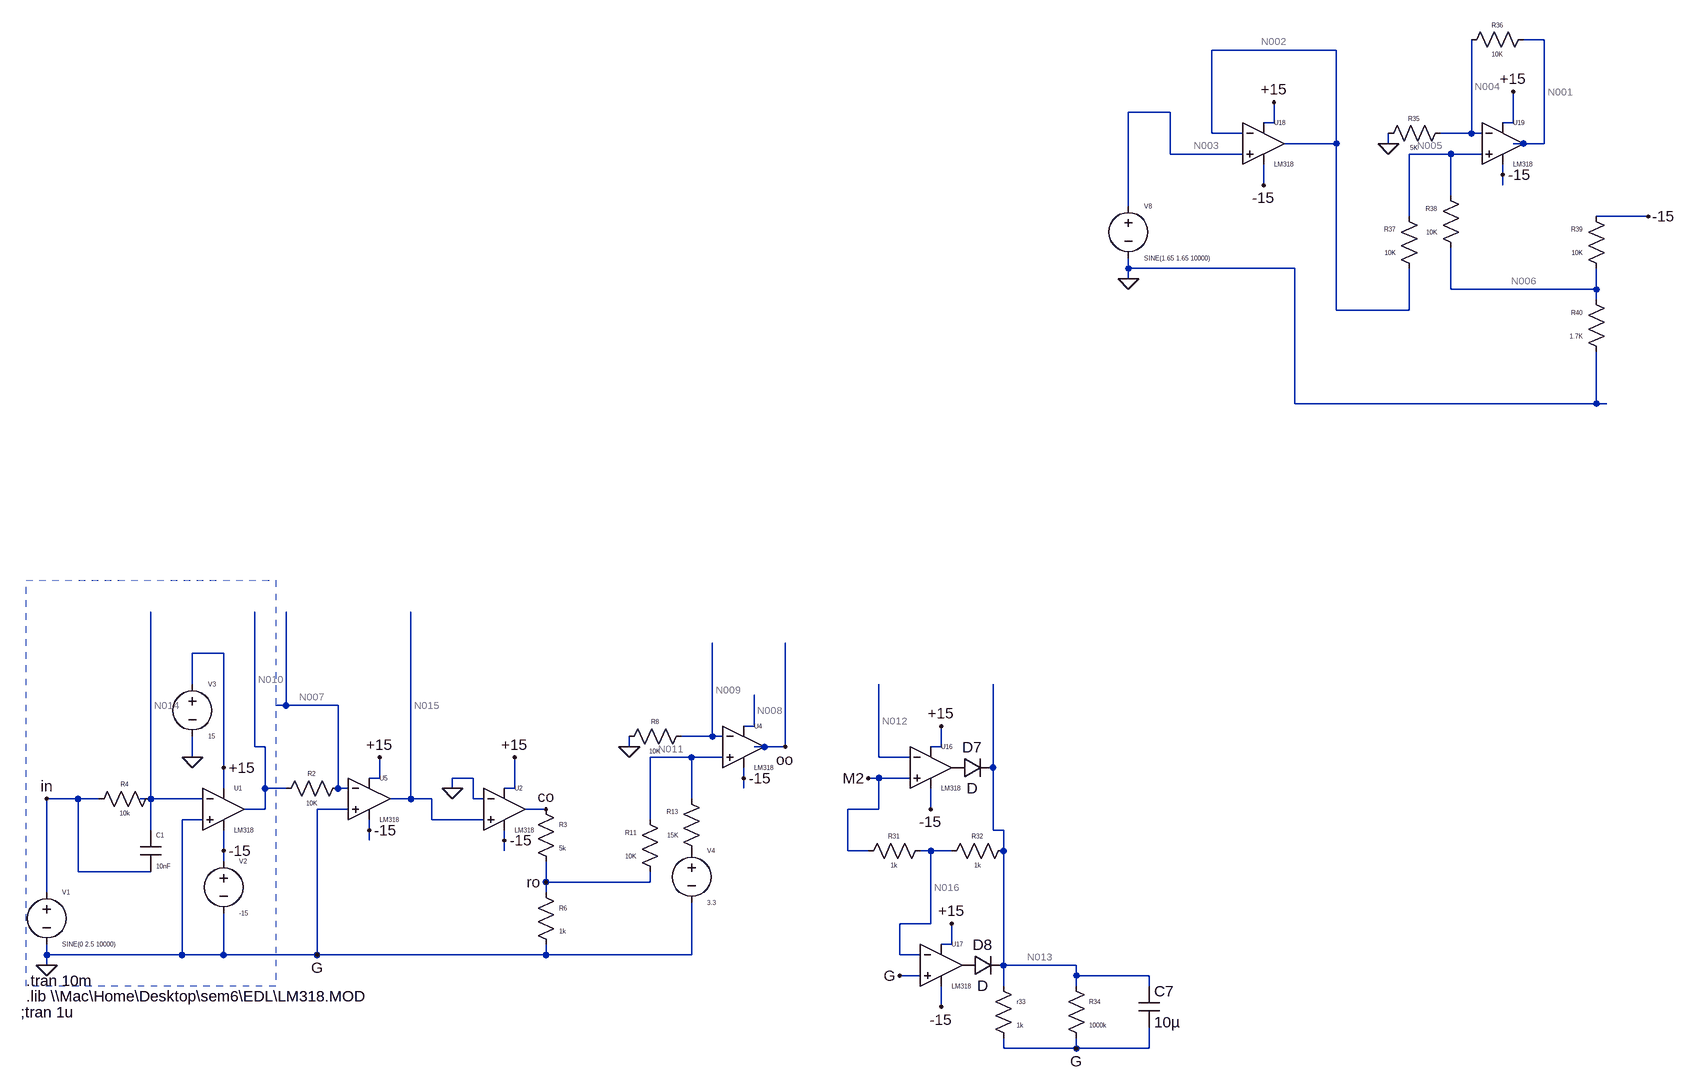
[diagram p0: schematic sir_lm.asc]
sir_lm.asc, the LTspice schematic file:
Version 4
SHEET 1 2856 1484
WIRE 2640 -1200 2608 -1200
WIRE 2320 -1184 2128 -1184
WIRE 2064 -1088 2000 -1088
WIRE 2224 -1072 2224 -1104
WIRE 2224 -1072 2208 -1072
WIRE 2592 -1072 2592 -1120
WIRE 2592 -1072 2576 -1072
WIRE 2128 -1056 2128 -1184
WIRE 2176 -1056 2128 -1056
WIRE 2528 -1056 2528 -1200
WIRE 2528 -1056 2480 -1056
WIRE 2544 -1056 2528 -1056
WIRE 2320 -1040 2320 -1184
WIRE 2320 -1040 2240 -1040
WIRE 2400 -1040 2400 -1056
WIRE 2608 -1040 2592 -1040
WIRE 2640 -1040 2640 -1200
WIRE 2640 -1040 2608 -1040
WIRE 2064 -1024 2064 -1088
WIRE 2176 -1024 2064 -1024
WIRE 2496 -1024 2432 -1024
WIRE 2544 -1024 2496 -1024
WIRE 2576 -992 2576 -1008
WIRE 2208 -976 2208 -1008
WIRE 2576 -976 2576 -992
WIRE 2496 -960 2496 -1024
WIRE 2000 -944 2000 -1088
WIRE 2432 -928 2432 -1024
WIRE 2800 -928 2720 -928
WIRE 2000 -848 2000 -864
WIRE 2256 -848 2000 -848
WIRE 2000 -832 2000 -848
WIRE 2496 -816 2496 -880
WIRE 2720 -816 2720 -848
WIRE 2720 -816 2496 -816
WIRE 2720 -800 2720 -816
WIRE 2320 -784 2320 -1040
WIRE 2432 -784 2432 -848
WIRE 2432 -784 2320 -784
WIRE 2256 -640 2256 -848
WIRE 2720 -640 2720 -720
WIRE 2720 -640 2256 -640
WIRE 2736 -640 2720 -640
WIRE 608 -256 560 -256
WIRE 560 -208 560 -256
WIRE 704 -176 704 -320
WIRE 704 -176 688 -176
WIRE 784 -176 704 -176
WIRE 1424 -144 1424 -192
WIRE 1424 -144 1408 -144
WIRE 1360 -128 1360 -272
WIRE 1360 -128 1312 -128
WIRE 1376 -128 1360 -128
WIRE 656 -112 656 -320
WIRE 672 -112 656 -112
WIRE 1232 -112 1232 -128
WIRE 1440 -112 1424 -112
WIRE 1472 -112 1472 -272
WIRE 1472 -112 1440 -112
WIRE 1712 -112 1712 -144
WIRE 1712 -112 1696 -112
WIRE 560 -96 560 -128
WIRE 1328 -96 1264 -96
WIRE 1376 -96 1328 -96
WIRE 1616 -96 1616 -208
WIRE 1664 -96 1616 -96
WIRE 608 -80 608 -256
WIRE 1792 -80 1792 -208
WIRE 848 -64 848 -96
WIRE 848 -64 832 -64
WIRE 992 -64 960 -64
WIRE 1408 -64 1408 -80
WIRE 1616 -64 1600 -64
WIRE 1664 -64 1616 -64
WIRE 608 -48 608 -80
WIRE 672 -48 672 -112
WIRE 704 -48 672 -48
WIRE 784 -48 784 -176
WIRE 800 -48 784 -48
WIRE 960 -48 960 -64
WIRE 1056 -48 1056 -96
WIRE 1056 -48 1040 -48
WIRE 1408 -48 1408 -64
WIRE 384 -32 336 -32
WIRE 416 -32 384 -32
WIRE 496 -32 496 -320
WIRE 496 -32 480 -32
WIRE 576 -32 496 -32
WIRE 896 -32 896 -320
WIRE 896 -32 864 -32
WIRE 928 -32 896 -32
WIRE 992 -32 992 -64
WIRE 1008 -32 992 -32
WIRE 1328 -32 1328 -96
WIRE 672 -16 672 -48
WIRE 672 -16 640 -16
WIRE 800 -16 752 -16
WIRE 1104 -16 1072 -16
WIRE 1616 -16 1616 -64
WIRE 1616 -16 1568 -16
WIRE 1696 -16 1696 -48
WIRE 576 0 544 0
WIRE 928 0 928 -32
WIRE 1008 0 928 0
WIRE 1264 0 1264 -96
WIRE 496 16 496 -32
WIRE 832 16 832 0
WIRE 1792 16 1792 -80
WIRE 1808 16 1792 16
WIRE 832 32 832 16
WIRE 1040 32 1040 16
WIRE 608 48 608 16
WIRE 1040 48 1040 32
WIRE 1568 48 1568 -16
WIRE 1600 48 1568 48
WIRE 1696 48 1680 48
WIRE 1728 48 1696 48
WIRE 1808 48 1808 16
WIRE 608 64 608 48
WIRE 384 80 384 -32
WIRE 496 80 384 80
WIRE 1104 96 1104 64
WIRE 1264 96 1264 80
WIRE 1264 96 1104 96
WIRE 336 112 336 -32
WIRE 1104 112 1104 96
WIRE 1696 160 1696 48
WIRE 1696 160 1648 160
WIRE 1728 192 1728 160
WIRE 1728 192 1712 192
WIRE 336 208 336 192
WIRE 544 208 544 0
WIRE 544 208 336 208
WIRE 608 208 608 144
WIRE 608 208 544 208
WIRE 752 208 752 -16
WIRE 752 208 608 208
WIRE 1104 208 1104 192
WIRE 1104 208 752 208
WIRE 1328 208 1328 128
WIRE 1328 208 1104 208
WIRE 1648 208 1648 160
WIRE 1680 208 1648 208
WIRE 336 224 336 208
WIRE 1808 224 1808 48
WIRE 1920 224 1808 224
WIRE 1680 240 1648 240
WIRE 1920 240 1920 224
WIRE 2032 240 1920 240
WIRE 1808 256 1808 224
WIRE 1920 256 1920 240
WIRE 2032 256 2032 240
WIRE 1712 288 1712 256
WIRE 1808 352 1808 336
WIRE 1920 352 1920 336
WIRE 1920 352 1808 352
WIRE 2032 352 2032 320
WIRE 2032 352 1920 352
FLAG 336 224 0
FLAG 336 -32 in
FLAG 560 -96 0
FLAG 960 -48 0
FLAG 1104 -16 co
FLAG 608 -80 +15
FLAG 848 -96 +15
FLAG 1056 -96 +15
FLAG 608 48 -15
FLAG 832 16 -15
FLAG 1040 32 -15
FLAG 1104 96 ro
FLAG 1232 -112 0
FLAG 1408 -64 -15
FLAG 1472 -112 oo
FLAG 752 208 G
FLAG 1712 -144 +15
FLAG 1696 -16 -15
FLAG 1728 160 +15
FLAG 1712 288 -15
FLAG 1648 240 G
FLAG 1920 352 G
FLAG 1600 -64 M2
FLAG 2000 -832 0
FLAG 2224 -1104 +15
FLAG 2208 -976 -15
FLAG 2400 -1040 0
FLAG 2592 -1120 +15
FLAG 2576 -992 -15
FLAG 2800 -928 -15
SYMBOL voltage 336 96 R0
WINDOW 0 24 16 Left 0
WINDOW 3 24 96 Left 0
WINDOW 123 0 0 Left 0
WINDOW 39 0 0 Left 0
SYMATTR InstName V1
SYMATTR Value SINE(0 2.5 10000)
SYMBOL res 512 -48 R90
WINDOW 0 0 56 VBottom 0
WINDOW 3 32 56 VTop 0
SYMATTR InstName R4
SYMATTR Value 10k
SYMBOL voltage 608 48 R0
WINDOW 0 24 16 Left 0
WINDOW 3 24 96 Left 0
WINDOW 123 0 0 Left 0
WINDOW 39 0 0 Left 0
SYMATTR InstName V2
SYMATTR Value -15
SYMBOL voltage 560 -224 R0
WINDOW 0 24 16 Left 0
WINDOW 3 24 96 Left 0
WINDOW 123 0 0 Left 0
WINDOW 39 0 0 Left 0
SYMATTR InstName V3
SYMATTR Value 15
SYMBOL cap 480 16 R0
WINDOW 0 24 8 Left 0
WINDOW 3 24 56 Left 0
SYMATTR InstName C1
SYMATTR Value 10nF
SYMBOL Opamps\\opamp2 608 -80 R0
WINDOW 0 16 32 Left 0
WINDOW 3 16 96 Left 0
SYMATTR InstName U1
SYMATTR Value LM318
SYMBOL Opamps\\opamp2 1040 -80 R0
WINDOW 0 16 32 Left 0
WINDOW 3 16 96 Left 0
SYMATTR InstName U2
SYMATTR Value LM318
SYMBOL Opamps\\opamp2 832 -96 R0
WINDOW 0 16 32 Left 0
WINDOW 3 16 96 Left 0
SYMATTR InstName U5
SYMATTR Value LM318
SYMBOL res 800 -64 R90
WINDOW 0 0 56 VBottom 0
WINDOW 3 32 56 VTop 0
SYMATTR InstName R2
SYMATTR Value 10K
SYMBOL res 1088 -32 R0
WINDOW 0 36 40 Left 0
WINDOW 3 36 76 Left 0
SYMATTR InstName R3
SYMATTR Value 5k
SYMBOL res 1088 96 R0
WINDOW 0 36 40 Left 0
WINDOW 3 36 76 Left 0
SYMATTR InstName R6
SYMATTR Value 1k
SYMBOL res 1328 -144 R90
WINDOW 0 0 56 VBottom 0
WINDOW 3 32 56 VTop 0
SYMATTR InstName R8
SYMATTR Value 10K
SYMBOL Opamps\\opamp2 1408 -176 R0
WINDOW 0 16 32 Left 0
WINDOW 3 16 96 Left 0
SYMATTR InstName U4
SYMATTR Value LM318
SYMBOL res 1280 96 R180
WINDOW 0 36 76 Left 0
WINDOW 3 36 40 Left 0
SYMATTR InstName R11
SYMATTR Value 10K
SYMBOL voltage 1328 32 R0
WINDOW 0 24 16 Left 0
WINDOW 3 24 96 Left 0
WINDOW 123 0 0 Left 0
WINDOW 39 0 0 Left 0
SYMATTR InstName V4
SYMATTR Value 3.3
SYMBOL res 1344 64 R180
WINDOW 0 36 76 Left 0
WINDOW 3 36 40 Left 0
SYMATTR InstName R13
SYMATTR Value 15K
SYMBOL Opamps\\opamp2 1696 -144 R0
WINDOW 0 16 32 Left 0
WINDOW 3 16 96 Left 0
SYMATTR InstName U16
SYMATTR Value LM318
SYMBOL diode 1728 -64 R270
WINDOW 0 32 32 VTop 2
WINDOW 3 0 32 VBottom 2
SYMATTR InstName D7
SYMBOL res 1696 32 R90
WINDOW 0 0 56 VBottom 0
WINDOW 3 32 56 VTop 0
SYMATTR InstName R31
SYMATTR Value 1k
SYMBOL res 1824 32 R90
WINDOW 0 0 56 VBottom 0
WINDOW 3 32 56 VTop 0
SYMATTR InstName R32
SYMATTR Value 1k
SYMBOL Opamps\\opamp2 1712 160 R0
WINDOW 0 16 32 Left 0
WINDOW 3 16 96 Left 0
SYMATTR InstName U17
SYMATTR Value LM318
SYMBOL diode 1744 240 R270
WINDOW 0 32 32 VTop 2
WINDOW 3 0 32 VBottom 2
SYMATTR InstName D8
SYMBOL res 1792 240 R0
WINDOW 0 36 40 Left 0
WINDOW 3 36 76 Left 0
SYMATTR InstName r33
SYMATTR Value 1k
SYMBOL res 1904 240 R0
WINDOW 0 36 40 Left 0
WINDOW 3 36 76 Left 0
SYMATTR InstName R34
SYMATTR Value 1000k
SYMBOL cap 2016 256 R0
SYMATTR InstName C7
SYMATTR Value 10µ
SYMBOL voltage 2000 -960 R0
WINDOW 0 24 16 Left 0
WINDOW 3 24 96 Left 0
WINDOW 123 0 0 Left 0
WINDOW 39 0 0 Left 0
SYMATTR InstName V8
SYMATTR Value SINE(1.65 1.65 10000)
SYMBOL Opamps\\opamp2 2208 -1104 R0
WINDOW 0 16 32 Left 0
WINDOW 3 16 96 Left 0
SYMATTR InstName U18
SYMATTR Value LM318
SYMBOL res 2496 -1072 R90
WINDOW 0 0 56 VBottom 0
WINDOW 3 32 56 VTop 0
SYMATTR InstName R35
SYMATTR Value 5K
SYMBOL res 2624 -1216 R90
WINDOW 0 0 56 VBottom 0
WINDOW 3 32 56 VTop 0
SYMATTR InstName R36
SYMATTR Value 10K
SYMBOL Opamps\\opamp2 2576 -1104 R0
WINDOW 0 16 32 Left 0
WINDOW 3 16 96 Left 0
SYMATTR InstName U19
SYMATTR Value LM318
SYMBOL res 2448 -832 R180
WINDOW 0 36 76 Left 0
WINDOW 3 36 40 Left 0
SYMATTR InstName R37
SYMATTR Value 10K
SYMBOL res 2512 -864 R180
WINDOW 0 36 76 Left 0
WINDOW 3 36 40 Left 0
SYMATTR InstName R38
SYMATTR Value 10K
SYMBOL res 2736 -832 R180
WINDOW 0 36 76 Left 0
WINDOW 3 36 40 Left 0
SYMATTR InstName R39
SYMATTR Value 10K
SYMBOL res 2736 -704 R180
WINDOW 0 36 76 Left 0
WINDOW 3 36 40 Left 0
SYMATTR InstName R40
SYMATTR Value 1.7K
TEXT 304 248 Left 2 !.tran 10m
TEXT 304 272 Left 2 !.lib \\\\Mac\\Home\\Desktop\\sem6\\EDL\\LM318.MOD
TEXT 296 296 Left 2 !;tran 1u
RECTANGLE Normal 688 256 304 -368 2

The netlist it stands for:
* sir_lm.asc
V1 in 0 SINE(0 2.5 10000)
R4 N014 in 10k
V2 -15 0 -15
V3 +15 0 15
C1 N014 in 10nF
XU1 0 N014 +15 -15 N010 LM318  ; pins In+ In- V+ V- OUT
XU2 N015 0 +15 -15 co LM318  ; pins In+ In- V+ V- OUT
XU5 0 N007 +15 -15 N015 LM318  ; pins In+ In- V+ V- OUT
R2 N007 N010 10K
R3 co ro 5k
R6 ro 0 1k
R8 N009 0 10K
XU4 N011 N009 N008 -15 oo LM318  ; pins In+ In- V+ V- OUT
R11 ro N011 10K
V4 P001 0 3.3
R13 P001 N011 15K
XU16 M2 N012 +15 -15 P002 LM318  ; pins In+ In- V+ V- OUT
D7 P002 N013 D
R31 N016 M2 1k
R32 N013 N016 1k
XU17 0 N016 +15 -15 P003 LM318  ; pins In+ In- V+ V- OUT
D8 P003 N013 D
r33 N013 0 1k
R34 N013 0 1000k
C7 N013 0 10µ
V8 N003 0 SINE(1.65 1.65 10000)
XU18 N003 N002 +15 -15 N002 LM318  ; pins In+ In- V+ V- OUT
R35 N004 0 5K
R36 N001 N004 10K
XU19 N005 N004 +15 -15 N001 LM318  ; pins In+ In- V+ V- OUT
R37 N002 N005 10K
R38 N006 N005 10K
R39 N006 -15 10K
R40 0 N006 1.7K
.model D D
.lib standard.dio
.tran 10m
.lib \\Mac\Home\Desktop\sem6\EDL\LM318.MOD
;tran 1u
.backanno
.end

* Results of the author's LTspice run, read from the files saved beside the schematic
* Operating Point, zero values left out:
*   V(n014) = -1.489 mV
*   V(-15) = -15 V
*   V(+15) = 15 V
*   V(n010) = 12.87 V
*   V(co) = -13.03 V
*   V(n015) = -13.03 V
*   V(n007) = 12.87 V
*   V(ro) = -2.689 V
*   V(n009) = -9.012 V
*   V(oo) = -12.98 V
*   V(n008) = -9.796 V
*   V(n011) = -8.892 V
*   V(p001) = 3.3 V
*   V(p002) = 13.03 V
*   V(n012) = 11.29 V
*   V(m2) = 12.31 V
*   V(n013) = 12.31 V
*   V(n016) = 12.31 V
*   V(p003) = -13.03 V
*   V(n003) = 1.65 V
*   V(n002) = 1.65 V
*   V(n004) = -135.9 mV
*   V(n001) = -406.1 mV
*   V(n005) = -135.9 mV
*   V(n006) = -1.92 V
*   I(D8) = -25.36 pA
*   I(D7) = 12.33 mA
*   I(R40) = 1.13 mA
*   I(R39) = 1.308 mA
*   I(R38) = -178.4 µA
*   I(R37) = 178.6 µA
*   I(R36) = -27.02 µA
*   I(R35) = -27.17 µA
*   I(R34) = 12.31 µA
*   I(R33) = 12.31 mA
*   I(R32) = 632.5 nA
*   I(R31) = 316.2 nA
*   I(R13) = 812.8 µA
*   I(R11) = 620.3 µA
*   I(R8) = -901.2 µA
*   I(R6) = -2.689 mA
*   I(R3) = -2.069 mA
*   I(R2) = -317.1 nA
*   I(R4) = -148.9 nA
*   I(V8) = -150.4 nA
*   I(V4) = -812.8 µA
*   I(V3) = -33.61 mA
*   I(V2) = 33.56 mA
*   I(V1) = -148.9 nA